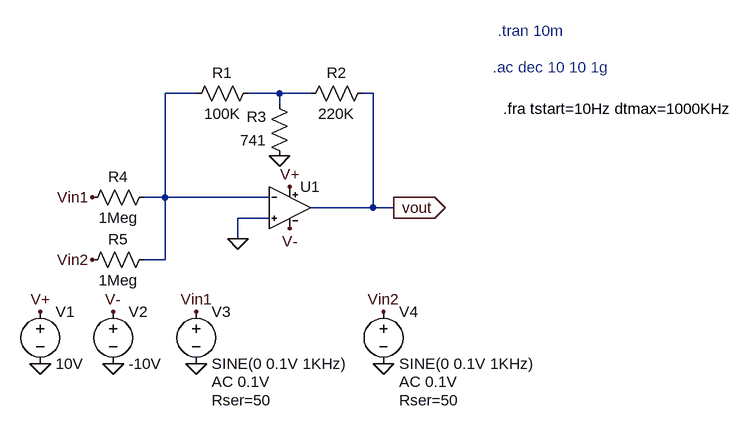
[diagram p0: schematic Lab2Circuit2.asc]
Lab2Circuit2.asc, the LTspice schematic file:
Version 4.1
SHEET 1 880 680
WIRE -16 -32 -64 -32
WIRE 112 -32 64 -32
WIRE 160 -32 112 -32
WIRE 256 -32 240 -32
WIRE 112 -16 112 -32
WIRE -64 128 -64 -32
WIRE -64 128 -96 128
WIRE 96 128 -64 128
WIRE 256 144 256 -32
WIRE 256 144 160 144
WIRE 288 144 256 144
WIRE 96 160 48 160
WIRE 48 192 48 160
WIRE -64 224 -64 128
WIRE -64 224 -96 224
FLAG 288 144 vout
IOPIN 288 144 Out
FLAG -256 304 V+
FLAG -144 304 V-
FLAG -16 304 Vin1
FLAG 272 304 Vin2
FLAG -176 224 Vin2
FLAG -176 128 Vin1
FLAG 128 112 V+
FLAG 128 176 V-
FLAG 48 192 0
FLAG -256 384 0
FLAG -144 384 0
FLAG -16 384 0
FLAG 272 384 0
FLAG 112 64 0
SYMBOL LM324 128 144 R0
SYMATTR InstName U1
SYMBOL res 80 -48 R90
WINDOW 0 0 56 VBottom 2
WINDOW 3 32 56 VTop 2
SYMATTR InstName R1
SYMATTR Value 100K
SYMBOL res 256 -48 R90
WINDOW 0 0 56 VBottom 2
WINDOW 3 32 56 VTop 2
SYMATTR InstName R2
SYMATTR Value 220K
SYMBOL res 128 80 R180
WINDOW 0 36 76 Left 2
WINDOW 3 36 40 Left 2
SYMATTR InstName R3
SYMATTR Value 741
SYMBOL res -192 144 R270
WINDOW 0 32 56 VTop 2
WINDOW 3 0 56 VBottom 2
SYMATTR InstName R4
SYMATTR Value 1Meg
SYMBOL res -192 240 R270
WINDOW 0 32 56 VTop 2
WINDOW 3 0 56 VBottom 2
SYMATTR InstName R5
SYMATTR Value 1Meg
SYMBOL voltage -256 288 R0
WINDOW 123 0 0 Left 0
WINDOW 39 0 0 Left 0
SYMATTR InstName V1
SYMATTR Value 10V
SYMBOL voltage -144 288 R0
WINDOW 123 0 0 Left 0
WINDOW 39 0 0 Left 0
SYMATTR InstName V2
SYMATTR Value -10V
SYMBOL voltage -16 288 R0
WINDOW 123 24 124 Left 2
WINDOW 39 24 152 Left 2
SYMATTR InstName V3
SYMATTR Value SINE(0 0.1V 1KHz)
SYMATTR Value2 AC 0.1V
SYMATTR SpiceLine Rser=50
SYMBOL voltage 272 288 R0
WINDOW 123 24 124 Left 2
WINDOW 39 24 152 Left 2
SYMATTR InstName V4
SYMATTR Value SINE(0 0.1V 1KHz)
SYMATTR Value2 AC 0.1V
SYMATTR SpiceLine Rser=50
TEXT 448 -128 Left 2 ;.tran 10m
TEXT 440 -72 Left 2 ;.ac dec 10 10 1g
TEXT 456 -8 Left 2 !.fra tstart=10Hz dtmax=1000KHz

The netlist it stands for:
* Lab2Circuit2.asc
X§U1 0 N001 V+ V- vout LM324  ; pins In+ In- V+ V- OUT
R1 N002 N001 100K
R2 vout N002 220K
R3 0 N002 741
R4 Vin1 N001 1Meg
R5 Vin2 N001 1Meg
V1 V+ 0 10V
V2 V- 0 -10V
V3 Vin1 0 SINE(0 0.1V 1KHz) AC 0.1V Rser=50
V4 Vin2 0 SINE(0 0.1V 1KHz) AC 0.1V Rser=50
* .tran 10m
* .ac dec 10 10 1g
.fra tstart=10Hz dtmax=1000KHz
.lib C:\Users\ivan_\OneDrive\Desktop\LM324.lib.txt
.backanno
.end